# Altium project PCB_Project_oxy.PrjPcb
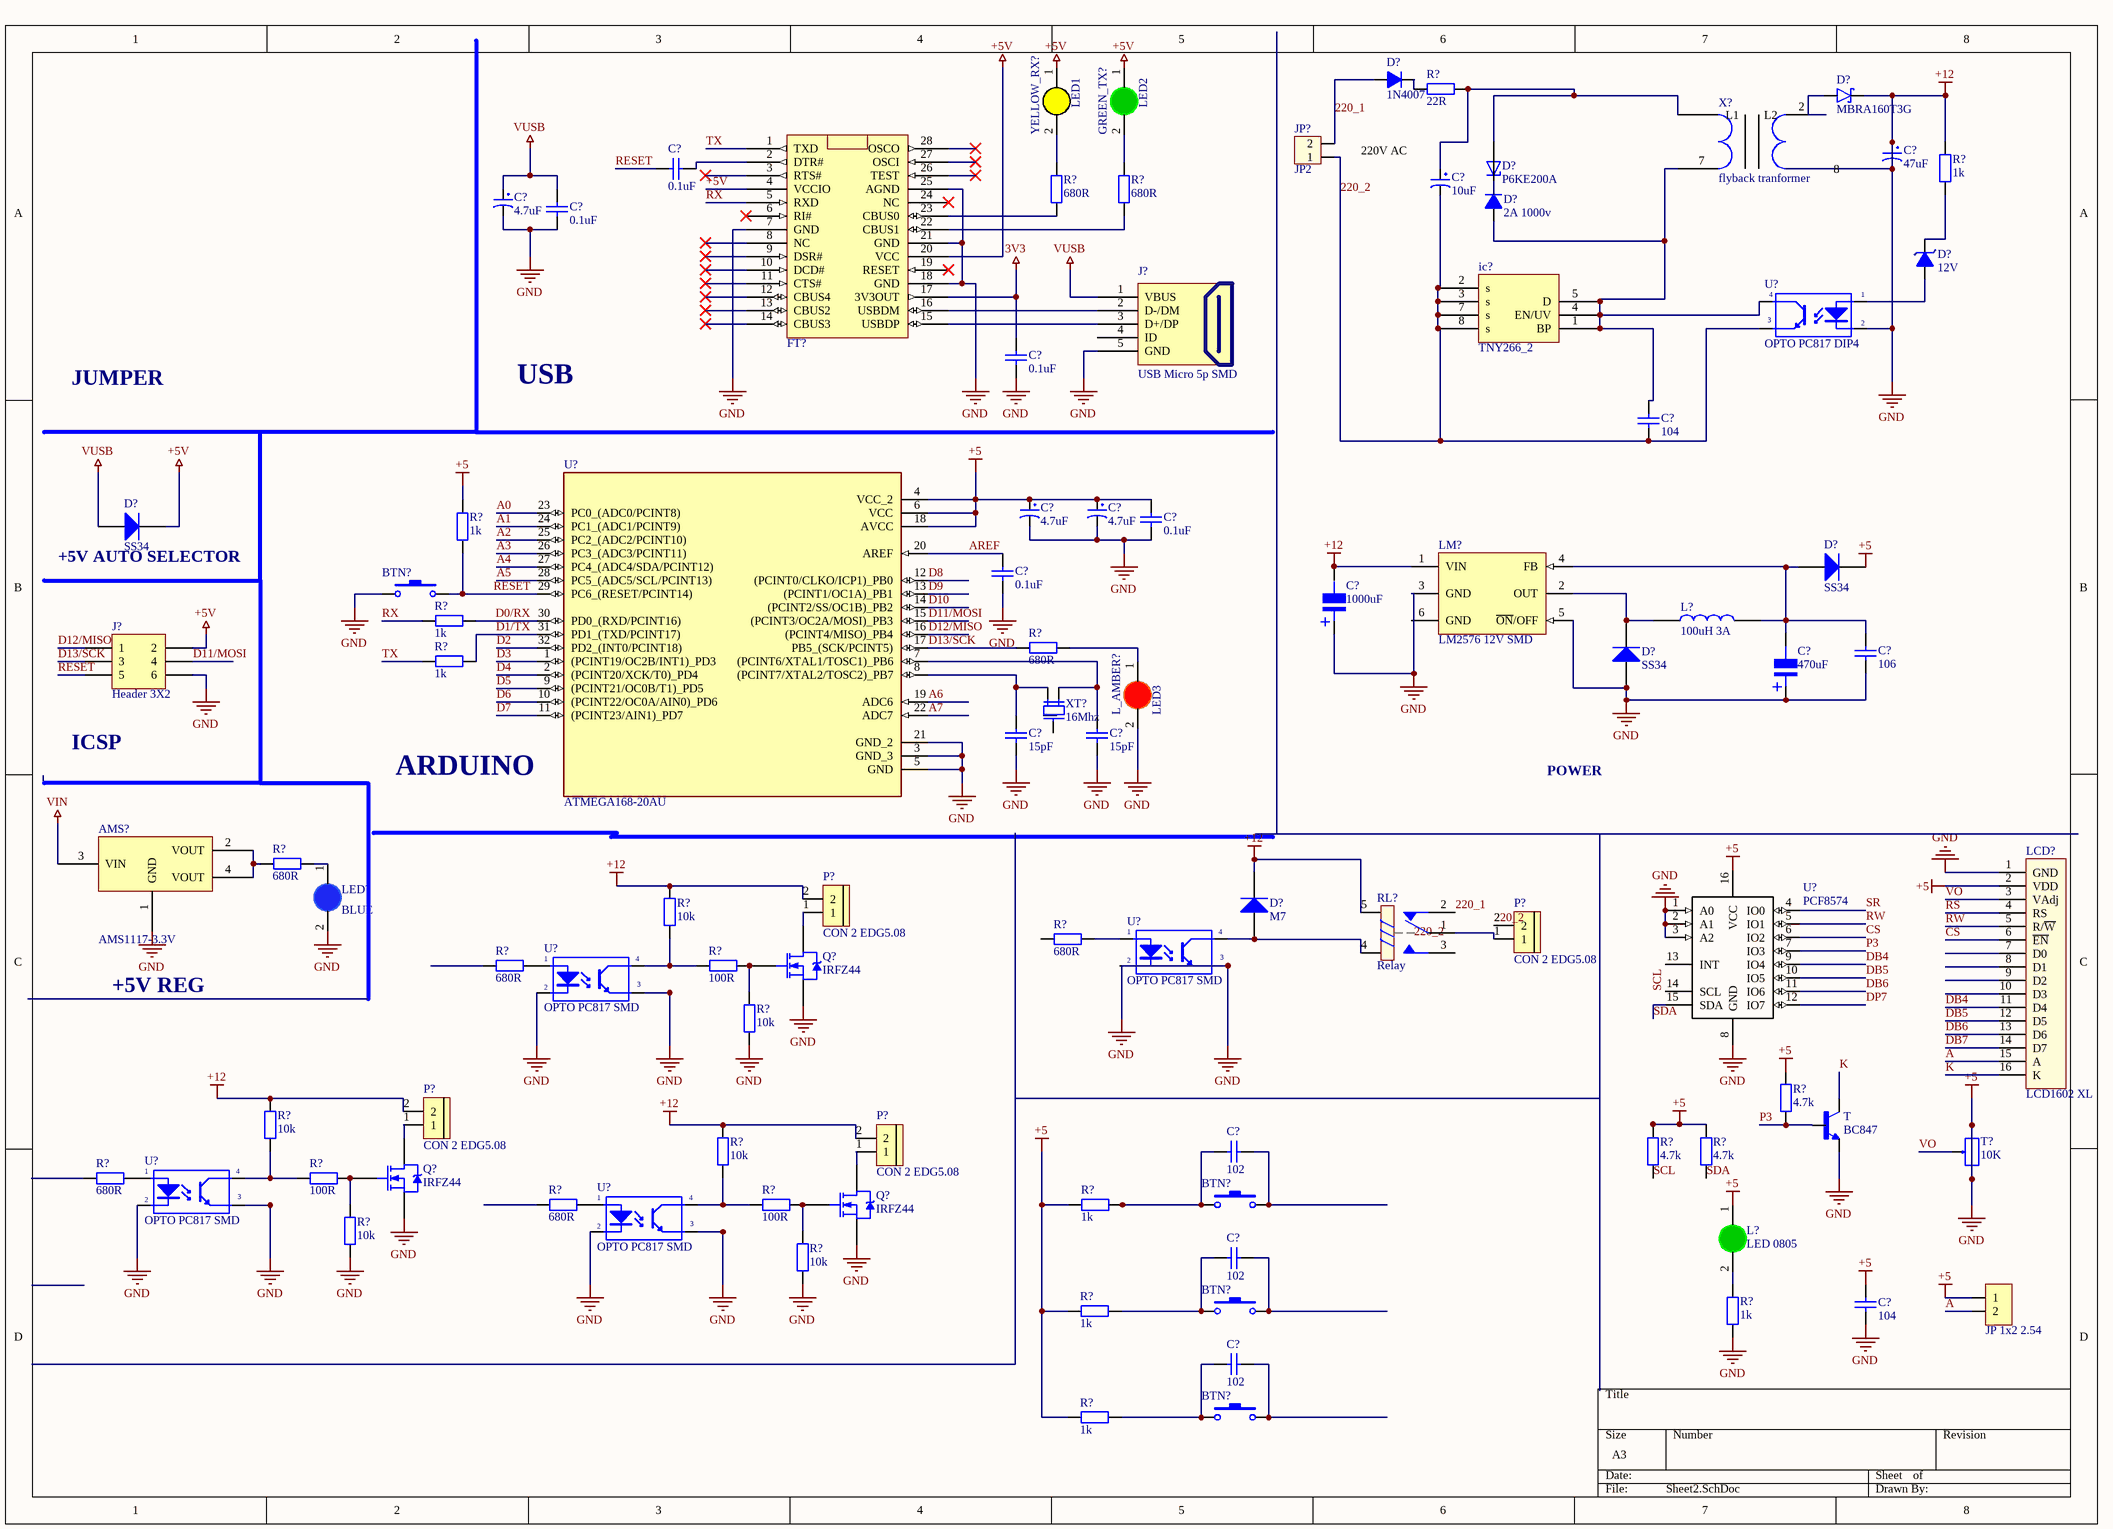
[diagram p0: Sheet2.SchDoc]
1 sheet, 96 parts. Net scope: global (net labels, ports and power ports of the same name join across sheets).
Board file: PCB2.PcbDoc

## Sheet Sheet2.SchDoc
size A3; SheetNumber: 1; SheetTotal: 1

### Parts
(Parts that share a designator on the sheet are numbered #1, #2 ... from top to bottom, then left to right.)
AMS?  AMS1117-3.3V  [SOT223]
BTN?#1  Nut Nhan 2 Chan SMD 3x6x2.5  [Nut Nhan 2 Chan SMD 3x6x2.5]  (value not drawn)
BTN?#2  Nut Nhan 2 Chan SMD 3x6x2.5  [Nut Nhan 2 Chan SMD 3x6x2.5]  (value not drawn)
BTN?#3  Nut Nhan 2 Chan SMD 3x6x2.5  [Nut Nhan 2 Chan SMD 3x6x2.5]  (value not drawn)
BTN?#4  Nut Nhan 2 Chan SMD 3x6x2.5  [Nut Nhan 2 Chan SMD 3x6x2.5]  (value not drawn)
C?#1  47uF  [tu hoa 5mm]
C?#2  0.1uF  [tu 0805]
C?#3  10uF  [tu hoa 13mm]
C?#4  4.7uF  [tu tantalum smd3216]
C?#5  0.1uF  [tu 0805]
C?#6  0.1uF  [tu 0805]
C?#7  104  [tu gom]
C?#8  4.7uF  [tu tantalum smd3216]
C?#9  4.7uF  [tu tantalum smd3216]
C?#10  0.1uF  [tu 0805]
C?#11  0.1uF  [tu 0805]
C?#12  1000uF  [tu nhom 10 (G)]
C?#13  106  [tu gom]
C?#14  470uF  [tu nhom 10 (G)]
C?#15  15pF  [tu 0805]
C?#16  15pF  [tu 0805]
C?#17  102  [tu 0805]
C?#18  102  [tu 0805]
C?#19  104  [tu 0805]
C?#20  102  [tu 0805]
D?#1  1N4007  [D1A]
D?#2  MBRA160T3G  [DIOM5226X220N]
D?#3  P6KE200A  [DIOAD1276W78L760D360]
D?#4  2A 1000v  [DIODE 2A DUNG]
D?#5  12V  [DIODE ZENNER SMD SOD80]
D?#6  SS34  [DIODE SMA]
D?#7  SS34  [DIODE SMA]
D?#8  SS34  [DIODE SMA]
D?#9  M7  [DIODE SMA]
FT?  FT232RL  [PCM5101APW]  (value not drawn)
GREEN_TX?  LED2  [LED-0805-Green]
ic?  TNY266_2  [DIP762W46P254L957H406Q7]
J?#1  USB Micro 5p SMD  [USB Mini 5p SMD]
J?#2  Header 3X2  [HDR2X3]
JP?#1  JP2  [CON2]
JP?#2  JP 1x2 2.54  [JP 1x2 DT]
L?#1  100uH 3A  [CUON_CAM 100UH]
L?#2  LED 0805  [LED-0805-Green]
L_AMBER?  LED3  [LED-0805-Red]
LCD?  LCD1602 XL  [LCD1602 with Jump]
LED?  BLUE  [LED-0805-Blue]
LM?  LM2576 12V SMD  [TO263-5]
P?#1  CON 2 EDG5.08  [CON 2 2EDG5.08]
P?#2  CON 2 EDG5.08  [CON 2 2EDG5.08]
P?#3  CON 2 EDG5.08  [CON 2 2EDG5.08]
P?#4  CON 2 EDG5.08  [CON 2 2EDG5.08]
Q?#1  IRFZ44  [TO220]
Q?#2  IRFZ44  [TO220]
Q?#3  IRFZ44  [TO220]
R?#1  22R  [tro vach 2w]
R?#2  1k  [tro smd 1206]
R?#3  680R  [tro smd 0603]
R?#4  680R  [tro smd 0603]
R?#5  1k  [tro smd 0603]
R?#6  1k  [tro smd 0603]
R?#7  680R  [tro smd 0603]
R?#8  1k  [tro smd 0603]
R?#9  680R  [tro smd 0603]
R?#10  10k  [tro smd 0603]
R?#11  680R  [tro cong suat 5w]
R?#12  680R  [tro cong suat 5w]
R?#13  100R  [tro vach 1/2w]
R?#14  10k  [tro smd 0603]
R?#15  4.7k  [tro smd 0603]
R?#16  10k  [tro smd 0603]
R?#17  10k  [tro smd 0603]
R?#18  4.7k  [tro smd 0603]
R?#19  4.7k  [tro smd 0603]
R?#20  680R  [tro cong suat 5w]
R?#21  100R  [tro vach 1/2w]
R?#22  680R  [tro cong suat 5w]
R?#23  100R  [tro vach 1/2w]
R?#24  1k  [tro smd 0603]
R?#25  10k  [tro smd 0603]
R?#26  10k  [tro smd 0603]
R?#27  1k  [tro smd 0603]
R?#28  1k  [tro smd 0603]
R?#29  1k  [tro smd 0603]
RL?  Relay  [Relay 5 Chan SRD]
T  BC847  [SOT23]
T?  10K  [Bien Tro Vi Chinh Dung]
U?#1  OPTO PC817 DIP4  [DIP4]
U?#2  ATMEGA168-20AU  [ATMEGA168]
U?#3  OPTO PC817 SMD  [SOP4]
U?#4  PCF8574  [DIP16]
U?#5  OPTO PC817 SMD  [SOP4]
U?#6  OPTO PC817 SMD  [SOP4]
U?#7  OPTO PC817 SMD  [SOP4]
X?  flyback tranformer  [flyback transformer]
XT?  16Mhz  [Thach Anh 3 Chan SMD]
YELLOW_RX?  LED1  [LED-0805-Yellow]

### Nets
3V3: C?#6.1 FT?.17(3V3OUT)
+5V: D?#6.2(K) FT?.4(VCCIO) FT?.20(VCC) GREEN_TX?.1(A) J?#2.2 YELLOW_RX?.1(A)
+12: AMS?.1(GND) BTN?#1.1 C?#1.1 C?#1.2 C?#4.2 C?#5.1 C?#6.2 C?#8.1 C?#8.2 C?#9.1 C?#9.2 C?#10.1 C?#10.2 C?#11.2 C?#12.1 C?#12.2 C?#13.2 C?#14.1 C?#15.2 C?#16.2 C?#19.1 C?#19.2 D?#2.C D?#7.2(K) D?#8.1(A) D?#9.2(K) FT?.7(GND) FT?.18(GND) FT?.21(GND) FT?.25(AGND) J?#1.5(GND) J?#2.6 JP?#2.1 L?#2.1(A) L_AMBER?.2(K) LCD?.1(GND) LCD?.2(VDD) LED?.2(K) LM?.1(VIN) LM?.3(GND) LM?.5(~{ON}/OFF) P?#1.2 P?#3.2 P?#4.2 Q?#1.3(S) Q?#2.3(S) Q?#3.3(S) R?#2.1 R?#5.2 R?#10.1 R?#14.2 R?#16.1 R?#17.1 R?#18.1 R?#19.1 R?#24.1 R?#25.2 R?#26.2 R?#27.1 R?#28.2 R?#29.1 RL?.5 T.2(E) T?.1 T?.3 U?#1.2(K) U?#2.3(GND_3) U?#2.4(VCC_2) U?#2.5(GND) U?#2.6(VCC) U?#2.18(AVCC) U?#2.21(GND_2) U?#3.3(E) U?#4.1(A0) U?#4.2(A1) U?#4.3(A2) U?#4.8(GND) U?#4.16(VCC) U?#5.2(K) U?#5.3(E) U?#6.2(K) U?#6.3(E) U?#7.2(K) U?#7.3(E) X?.8  [also labelled +5, GND]
VIN: AMS?.3(VIN)
VUSB: C?#4.1 C?#5.2 D?#6.1(A) J?#1.1(VBUS)
220_1: D?#1.1(A) JP?#1.2 RL?.2
220_2: C?#3.2 C?#7.1 ic?.2(s) ic?.3(s) ic?.7(s) ic?.8(s) JP?#1.1 P?#2.2 U?#1.3(E)
A: JP?#2.2 LCD?.15(A)
A0: U?#2.23(PC0_(ADC0/PCINT8))
A1: U?#2.24(PC1_(ADC1/PCINT9))
A2: U?#2.25(PC2_(ADC2/PCINT10))
A3: U?#2.26(PC3_(ADC3/PCINT11))
A4: U?#2.27(PC4_(ADC4/SDA/PCINT12))
A5: U?#2.28(PC5_(ADC5/SCL/PCINT13))
A6: U?#2.19(ADC6)
A7: U?#2.22(ADC7)
AREF: C?#11.1 U?#2.20(AREF)
CS: LCD?.6(~{EN}) U?#4.6(IO2)
D0/RX: R?#6.2 U?#2.30(PD0_(RXD/PCINT16))
D1/TX: R?#8.2 U?#2.31(PD1_(TXD/PCINT17))
D2: U?#2.32(PD2_(INT0/PCINT18))
D3: U?#2.1((PCINT19/OC2B/INT1)_PD3)
D4: U?#2.2((PCINT20/XCK/T0)_PD4)
D5: U?#2.9((PCINT21/OC0B/T1)_PD5)
D6: U?#2.10((PCINT22/OC0A/AIN0)_PD6)
D7: U?#2.11((PCINT23/AIN1)_PD7)
D8: U?#2.12((PCINT0/CLKO/ICP1)_PB0)
D9: U?#2.13((PCINT1/OC1A)_PB1)
D10: U?#2.14((PCINT2/SS/OC1B)_PB2)
D11/MOSI: J?#2.4 U?#2.15((PCINT3/OC2A/MOSI)_PB3)
D12/MISO: J?#2.1 U?#2.16((PCINT4/MISO)_PB4)
D13/SCK: J?#2.3 R?#7.1 U?#2.17(PB5_(SCK/PCINT5))
DB4: LCD?.11(D4) U?#4.9(IO4)
DB5: LCD?.12(D5) U?#4.10(IO5)
DB6: LCD?.13(D6) U?#4.11(IO6)
DB7: LCD?.14(D7)
DP7: U?#4.12(IO7)
K: LCD?.16(K) T.3(C)
P3: R?#15.2 T.1(B) U?#4.7(IO3)
RESET: BTN?#1.2 C?#2.2 J?#2.5 R?#5.1 U?#2.29(PC6_(RESET/PCINT14))
RS: LCD?.4(RS)
RW: LCD?.5(R/~{W}) U?#4.5(IO1)
RX: FT?.5(RXD) R?#6.1
SCL: R?#18.2 U?#4.14(SCL)
SDA: R?#19.2
SR: U?#4.4(IO0)
TX: FT?.1(TXD) R?#8.1
VO: LCD?.3(VAdj) T?.2
NetAMS?_2: AMS?.2(VOUT) AMS?.4(VOUT) R?#9.1
NetBTN?#2_1: BTN?#2.1 C?#17.2 R?#24.2
NetBTN?#2_2: BTN?#2.2 C?#17.1
NetBTN?#3_1: BTN?#3.1 C?#18.2 R?#27.2
NetBTN?#3_2: BTN?#3.2 C?#18.1
NetBTN?#4_1: BTN?#4.1 C?#20.2 R?#29.2
NetBTN?#4_2: BTN?#4.2 C?#20.1
NetC?#2_1: C?#2.1 FT?.2(DTR#)
NetC?#3_1: C?#3.1 D?#3.A R?#1.2 X?.1(L1)
NetC?#7_2: C?#7.2 D?#4.1(A) ic?.1(BP) ic?.4(EN/UV) ic?.5(D) U?#1.4(C) X?.7
NetC?#13_1: C?#13.1 C?#14.2 D?#7.1(A) L?#1.2 LM?.4(FB)
NetC?#15_1: C?#15.1 U?#2.8((PCINT7/XTAL2/TOSC2)_PB7) XT?.3
NetC?#16_1: C?#16.1 U?#2.7((PCINT6/XTAL1/TOSC1)_PB6) XT?.1
NetD?#1_2: D?#1.2(K) R?#1.1
NetD?#2_A: D?#2.A X?.2(L2)
NetD?#3_C: D?#3.C D?#4.2(K)
NetD?#5_1: D?#5.1(A) U?#1.1(A)
NetD?#5_2: D?#5.2(K) R?#2.2
NetD?#8_2: D?#8.2(K) L?#1.1 LM?.2(OUT)
NetD?#9_1: D?#9.1(A) RL?.4 U?#3.4(C)
NetFT?_15: FT?.15(USBDP) J?#1.3(D+/DP)
NetFT?_16: FT?.16(USBDM) J?#1.2(D-/DM)
NetFT?_22: FT?.22(CBUS1) R?#4.1
NetFT?_23: FT?.23(CBUS0) R?#3.1
NetGREEN_TX?_2: GREEN_TX?.2(K) R?#4.2
NetL?#2_2: L?#2.2(K) R?#28.1
NetL_AMBER?_1: L_AMBER?.1(A) R?#7.2
NetLED?_1: LED?.1(A) R?#9.2
NetP?#1_1: P?#1.1 Q?#1.2(D)
NetP?#2_1: P?#2.1 RL?.1
NetP?#3_1: P?#3.1 Q?#2.2(D)
NetP?#4_1: P?#4.1 Q?#3.2(D)
NetQ?#1_1: Q?#1.1(G) R?#13.2 R?#14.1
NetQ?#2_1: Q?#2.1(G) R?#21.2 R?#25.1
NetQ?#3_1: Q?#3.1(G) R?#23.2 R?#26.1
NetR?#3_2: R?#3.2 YELLOW_RX?.2(K)
NetR?#10_2: R?#10.2 R?#13.1 U?#5.4(C)
NetR?#11_2: R?#11.2 U?#3.1(A)
NetR?#12_2: R?#12.2 U?#5.1(A)
NetR?#16_2: R?#16.2 R?#21.1 U?#6.4(C)
NetR?#17_2: R?#17.2 R?#23.1 U?#7.4(C)
NetR?#20_2: R?#20.2 U?#6.1(A)
NetR?#22_2: R?#22.2 U?#7.1(A)

Not connected (* = marked no-connect by the designer): FT? 3(RTS#)* 6(RI#)* 8(NC)* 9(DSR#)* 10(DCD#)* 11(CTS#)* 12(CBUS4)* 13(CBUS2)* 14(CBUS3)* 19(RESET)* 24(NC)* 26(TEST)* 27(OSCI)* 28(OSCO)*; J?#1 4(ID); LCD? 7(D0) 8(D1) 9(D2) 10(D3); LM? 6(GND); R?#11 1; R?#12 1; R?#15 1; R?#20 1; R?#22 1; RL? 3; U?#3 2(K); U?#4 13(INT) 15(SDA); XT? 2

### Buses and harness runs
bus SDA

### Notes on the sheet
- (near JP?#1) Text
- 220V AC
- JUMPER
- USB
- (near D?#6) +5V AUTO SELECTOR
- ICSP
- ARDUINO
- POWER
- +5V REG
- Labels drawn without touching a wire or pin: 220_2, +5
- (in symbol Tu Nhom 470uF 35V) +
- (in symbol Tu Nhom 1000uF 10V) +

### Library data of the parts
AMS? = AMS1117 SMD: Dán; Value: AMS1117-3.3V SOT223; Don_Vi: Con; Ma_Hang: MH000596; Ghi_Chu: *; Kieu_Chan: *; Chung_Loai: Dán
BTN?#1-BTN?#4 = Nut Nhan 2 Chan SMD 3x6x2.5: Ma_Hang: MH001036; Ten: Nút Nhấn 2 Chân 3x6x2.5MM SMD
C?#1 = Tu Hoa 47uF 25V 5x8: Cắm; Don_Vi: Con; So_Chan: 2; Ten_Linh_Kien: Tụ Hóa 47uF 25V; Ma_Hang: MH006860; Chung_Loai: Cắm; Kieu_Chan: *
C?#2 C?#5 C?#6 C?#10 C?#11 = Tu 0805 10pF 50V 10%: Dán; Don_Vi: Con; So_Chan: 2; Ten_Linh_Kien: Tụ 0805 10P 10% 50V; Ma_Hang: MH004554; Chung_Loai: Dán; Kieu_Chan: *
C?#3 = Tu Hoa 10uF 450V 13x20: Cắm; Don_Vi: Con; So_Chan: 2; Ten_Linh_Kien: Tụ Hóa 10uF 450V 13x20MM; Ma_Hang: MH003950; Chung_Loai: Cắm; Kieu_Chan: *
C?#4 C?#8 C?#9 = Tu tantalum 4.7uF 16V SMD3216: Dán; Don_Vi: Con; So_Chan: 2; Ten_Linh_Kien: Tụ tantalum 475C-4.7uF 16V SMD3216; Ma_Hang: MH008686; Chung_Loai: Dán; Kieu_Chan: *
C?#7 C?#13 = Tu gom 104 50V: Cắm; So_Chan: 2; Ten_Linh_Kien: Tụ gốm 104 100nF 50V; Don_Vi: Con; Ma_Hang: MH004761; Chung_Loai: Cắm; Kieu_Chan: *
C?#12 = Tu Nhom 1000uF 10V: Dán; So_Chan: 2; Don_Vi: Con; Ten_Linh_Kien: Tụ Nhôm 1000uF 10V; Ma_Hang: MH007515; Chung_Loai: Dán; Kieu_Chan: *
C?#14 = Tu Nhom 470uF 35V: Dán; Don_Vi: Con; So_Chan: 2; Ten_Linh_Kien: Tụ Nhôm 470uF 35V 10x10.5MM; Ma_Hang: MH004418; Chung_Loai: Dán; Kieu_Chan: *
C?#15 C?#16 = Tu 0805 15pF 50V 10%: Dán; Don_Vi: Con; So_Chan: 2; Ten_Linh_Kien: Tụ 0805 15P 10% 50V; Ma_Hang: MH004556; Chung_Loai: Dán; Kieu_Chan: *
C?#17 C?#18 C?#20 = Tu 0805 102 50V 10%: Dán; Don_Vi: Con; So_Chan: 2; Ten_Linh_Kien: Tụ 0805 102-1nF 10% 50V; Ma_Hang: MH004549; Chung_Loai: Dán; Kieu_Chan: *
C?#19 = Tu 0805 104 50V 10%: Dán; Don_Vi: Con; So_Chan: 2; Ten_Linh_Kien: Tụ 0805 104-100nF 10% 50V; Ma_Hang: MH004551; Chung_Loai: Dán; Kieu_Chan: *
D?#1 = D1A: Diode 1A; Value: 1N4007
D?#2 = MBRA160T3G: Diode Schottky 60V 1A Surface Mount SMA; MF: ON Semiconductor; Availability: Unavailable; SnapEDA_Link: https://www.snapeda.com/parts/MBRA160T3G/ON%20Semiconductor/view-part/313183/?ref=snap; Price: None; Package: DO-214 ON Semiconductor; MP: MBRA160T3G; Value: *
D?#3 = P6KE200A: 600W, 200V, 5%, Unidirectional, TVS; MF: Taiwan Semiconductor; Package: AXIAL-2 Taiwan Semiconductor; Value: *; MP: P6KE200A; Availability: In Stock; Purchase-URL: https://pricing.snapeda.com/search/part/P6KE200A/?ref=eda; Price: None
D?#4 = Diode FR207: Cắm; Ten_Linh_Kien: Diode FR207 2A 1000V ( DIP); Don_Vi: Con; Ma_Hang: MH005704; Ghi Chu: *; Kieu_Chan: *; Chung_Loai: Cắm
D?#5 = Diode Zener 12V: Dán; Ma_Hang: MH000945; Don_Vi: Con; Ten_Linh_Kien: Diode Zener 1/2W 12V SMD1206 ZMM12; Kieu_Chan: *; Ghi_Chu: *; Chung_Loai: Dán
D?#6-D?#8 = Diode SS34 ( 1N5822 ): Dán; Don_Vi: Con; Ma_Hang: MH002104; Ten_Linh_Kien: Diode SS34 3A 40V SMA ( 1N5822 SS34A); Kieu_Chan: *; Chung_Loai: Dán
D?#9 = Diode M7 ( 4007 ): Dán; Don_Vi: Con; Ten_Linh_Kien: Diode M7 1N4007 SMD 1A 1000V; Ma_Hang: MH000944; Chung_Loai: Dán; Ghi_Chu: *
GREEN_TX? L?#2 = LED 0805 Xanh La: Dán; Don_Vi: Con; Ma_Hang: MH002326; Ten_Linh_Kien: LED 0805 Màu Xanh Lá (Green); Ghi_Chu: *; Kieu_Chan: *; Chung_Loai: Dán
J?#1 = USB Micro 5p SMD: USB Type B; Ten: MicroUSB MK5P SMD; Ma_Hang: MH001020
J?#2 = Header 3X2: Header, 3-Pin, Dual row; LatestRevisionDate: 17-Jul-2002; LatestRevisionNote: Re-released for DXP Platform.; Publisher: Altium Limited
JP?#1 = Con2: Connector 2; Value: Connector 2
JP?#2 = JP 1x2 2.54 Duc Thang: Cắm; Ten_Linh_Kien: Jump Đơn Đực 2.54MM 1x40P Thẳng 11MM; Don_Vi: Con; Ma_Hang: MH000903; Ghi_Chu: *; Kieu_Chan: *; Chung_Loai: Cắm
L?#1 = CUON CAM 100uH DIP: Dán; Don_Vi: Con; Ma_Hang: MH002209; Ten_Linh_Kien: Cuộn Cảm 100uH 3A 8x10MM; Chung_Loai: Dán; Ghi Chu: *; Kieu Chan: *
L_AMBER? = LED 0805 Do: Dán; Don_Vi: Con; Ma_Hang: MH000897; Ten_Linh_Kien: LED 0805 Màu Đỏ (Red); Ghi_Chu: *; Kieu_Chan: *; Chung_Loai: Dán
LCD? = LCD1602 XL: LCD 1602 Xanh Lá; Ten: Màn hình LCD 1602 Xanh Lá; Ma_Hang: 67HZ; NCC: NSHOP; CHIP: HD44780
LED? = LED 0805 Xanh Duong: Dán; Don_Vi: Con; Ma_Hang: MH002327; Ten_Linh_Kien: LED 0805 Màu Xanh Dương (Blue); Ghi_Chu: *; Kieu_Chan: *; Chung_Loai: Dán
LM? = LM2576 12V SMD: Dán; Don_Vi: Con; Ma_Hang: MH002369; Ten_Linh_Kien: LM2576HVS-12V BUCK 12V 3A TO263-5; Ghi_Chu: *; Kieu_Chan: *; Chung_Loai: Dán
P?#1-P?#4 = CON 2 EDG5.08: Cắm; Ten_Linh_Kien: CON 2 2EDG5.08-2P 5.08MM ( Xanh Cong); Ma_Hang: MH000759; Ghi_Chu: *; Don_Vi: Con; Kieu_Chan: *; Chung_Loai: Cắm
Q?#1-Q?#3 = IRFZ44 DIP: N-Channel Power MOSFET
R?#1 = Tro Vach 2W 5% 22R: Cắm; Don_Vi: Con; So_Chan: 2; Ten_Linh_Kien: Trở 5% 2w 22R; Ma_Hang: MH006369; Chung_Loai: Cắm; Kieu_Chan: *
R?#2 = Tro 1206 1% 1k: Dán; Don_Vi: Con; So_Chan: 2; Ten_Linh_Kien: Trở 1206 1% 1k; Ma_Hang: MH005880; Chung_Loai: Dán; Kieu_Chan: *
R?#3 R?#4 R?#7 R?#9 = Tro 0603 1% 680R: Dán; Don_Vi: Con; So_Chan: 2; Ten_Linh_Kien: Trở 0603 1% 680R; Ma_Hang: MH006336; Chung_Loai: Dán; Kieu_Chan: *
R?#5 R?#6 R?#8 R?#28 = Tro 0603 1% 1k: Dán; So_Chan: 2; Don_Vi: Con; Ten_Linh_Kien: Trở 0603 1% 1k; Ma_Hang: MH006334; Chung_Loai: Dán; Kieu_Chan: *
R?#10 R?#14 R?#16 R?#17 R?#25 R?#26 = Tro 0603 1% 10k: Dán; Don_Vi: Con; So_Chan: 2; Ten_Linh_Kien: Trở 0603 1% 10k; Ma_Hang: MH006333; Chung_Loai: Dán; Kieu_Chan: *
R?#11 R?#12 R?#20 R?#22 = Tro Cong Suat 5W 5% 680R: Cắm; So_Chan: 2; Ten_Linh_Kien: Trở Sứ 5w 5% 680R; Don_Vi: Con; Ma_Hang: MH007107; Chung_Loai: Cắm; Kieu_Chan: *
R?#13 R?#21 R?#23 = Tro Vach 1/2W 5% 100R: Cắm; So_Chan: 2; Ten_Linh_Kien: Trở 5% 1/2w 100R; Ma_Hang: MH007106; Don_Vi: Con; Chung_Loai: Cắm; Kieu_Chan: *
R?#15 R?#18 R?#19 = Tro 0603 5% 4.7k: Dán; Don_Vi: Con; So_Chan: 2; Ten_Linh_Kien: Trở 0603 5% 4.7k; Ma_Hang: MH006327; Chung_Loai: Dán; Kieu_Chan: *
R?#24 R?#27 R?#29 = Tro 0603 5% 1k: Dán; Don_Vi: Con; So_Chan: 2; Ten_Linh_Kien: Trở 0603 5% 1k; Ma_Hang: MH006319; Chung_Loai: Dán; Kieu_Chan: *
RL? = Relay 5 Chan SRD: Relay 5 Chan; Ma_Hang: MH009374; Ten: Relay 5V10A SRD-05VDC-SL-C Chính Hãng
T = BC847: Bipolar _BJT_ Transistor NPN 45V 100mA 100MHz 150mW Surface Mount SOT-523; MF: Rectron; Package: SOT-523 Rectron; Value: *; Price: None; MP: BC847; SnapEDA_Link: https://www.snapeda.com/parts/BC847/Rectron/view-part/4637030/?ref=snap; Availability: Unavailable
T? = Bien Tro Tinh Chinh 10K Dung: Cắm; Ma_Hang: MH003232; Ten_Linh_Kien: Biến Trở VR 103-10K 3296W; Don_Vi: Con; Kieu_Chan: *; Chung_Loai: Cắm; Ghi_Chu: *
U?#1 = OPTO PC817 DIP4: Single Opto; Value: PC817
U?#2 = ATMEGA168-20AU: AVR AVRÂ® ATmega Microcontroller IC 8-Bit 20MHz 16KB _8K x 16_ FLASH 32-TQFP _7x7_; MF: Microchip; MP: ATMEGA168-20AU; Availability: Unavailable; Package: TQFP-32 Microchip; Price: None; SnapEDA_Link: https://www.snapeda.com/parts/ATMEGA168-20AU/Microchip/view-part/776709/?ref=snap; Value: *
U?#3 U?#5-U?#7 = OPTO PC817 SMD: Single Opto; Value: PC817
U?#4 = PCF8574: I2C PORT EXPANDER; Manufacturer Part Number: PCF8574T/3,512; Manufacturer: NXP Semiconductors; Includes: POR; Interface: I²C; Interrupt Output: Yes; Number of I /O: 8; Voltage - Supply: 2.5 V ~ 6 V; Frequency - Clock: 100KHz; Supplier 1: Digi-Key; Supplier Part Number 1: 568-1076-5-ND; Package / Case: 16-SOIC (7.5mm Width); Category: Integrated Circuits (ICs); Supplier Part Number: 568-1076-5-ND; Operating Temperature: -40°C ~ 85°C; Packaging: Tube; RoHS: RoHS Compliant; Supplier: Digi-Key
XT? = Thach anh 3 Chan SMD: Crystal For all Crystal 2pin.; Value: 4Mhz
YELLOW_RX? = LED 0805 Vang: Dán; Don_Vi: Con; Ma_Hang: MH002329; Ten_Linh_Kien: LED 0805 Màu Vàng ( Yellow); Ghi_Chu: *; Kieu_Chan: *; Chung_Loai: Dán